# EAGLE board MTX_Tap_an_er_V11 (EAGLE 6.5.0)
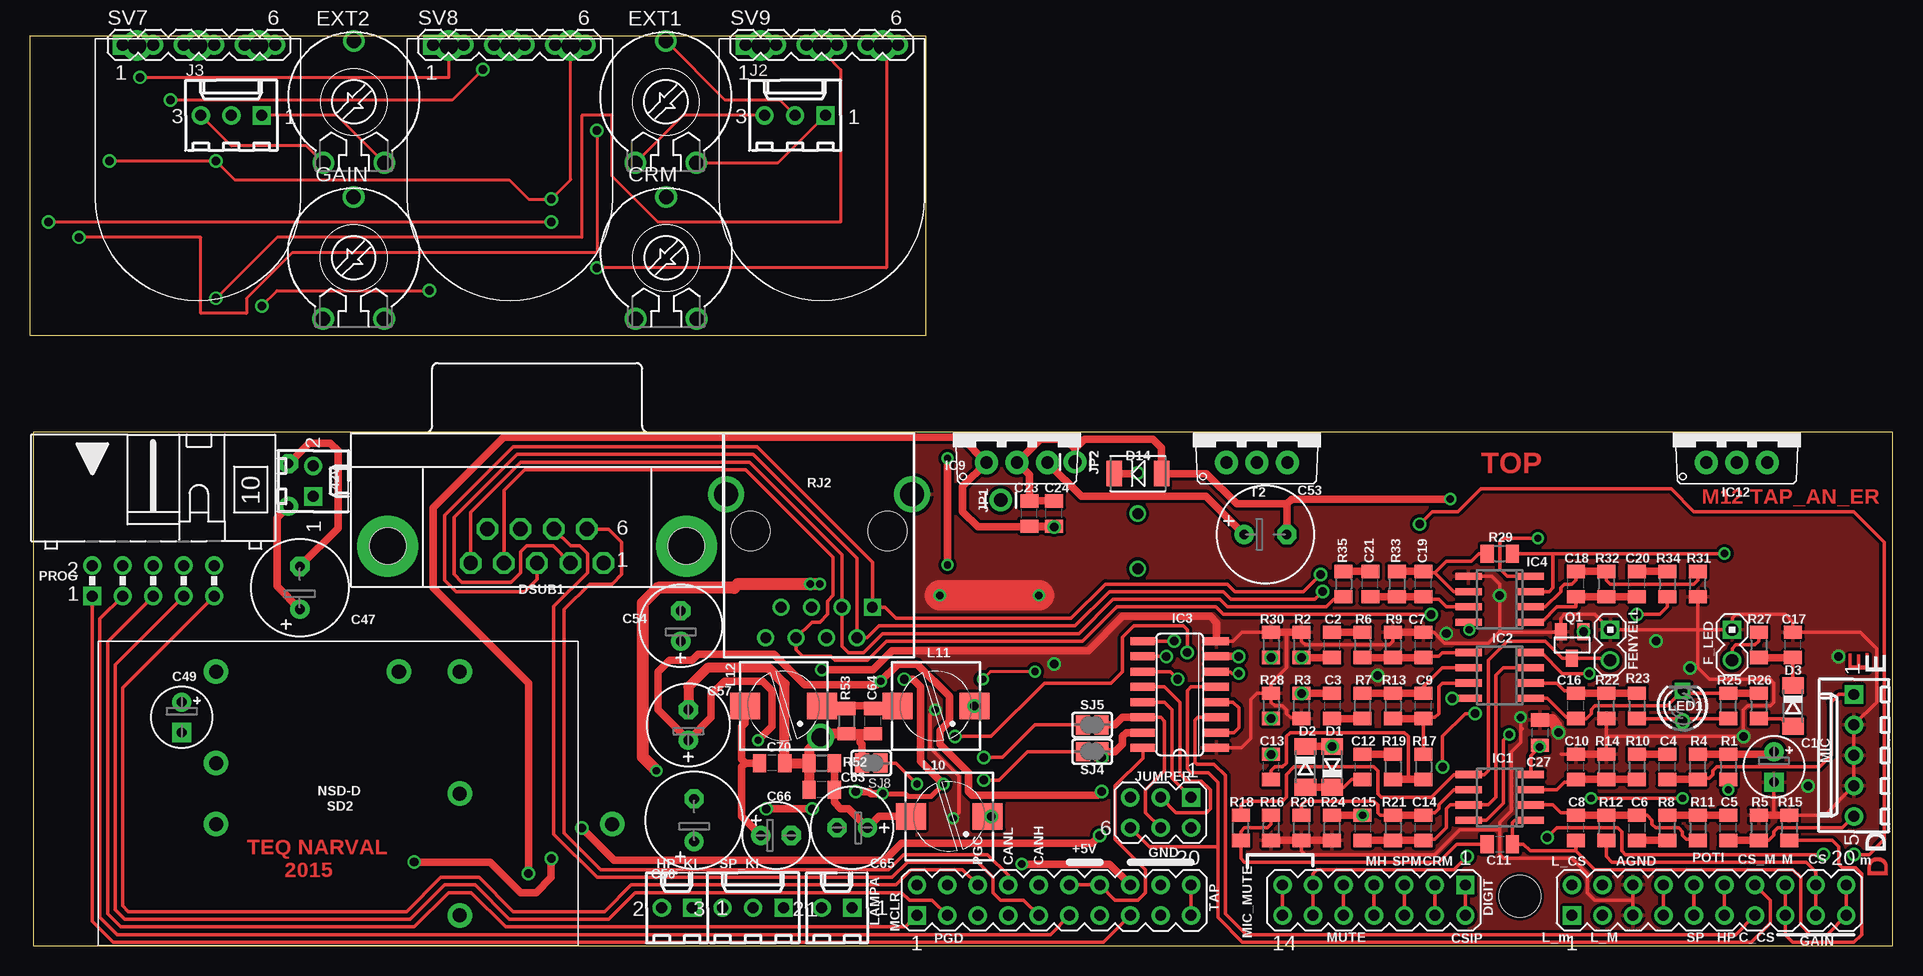
[diagram p2: board, top side]
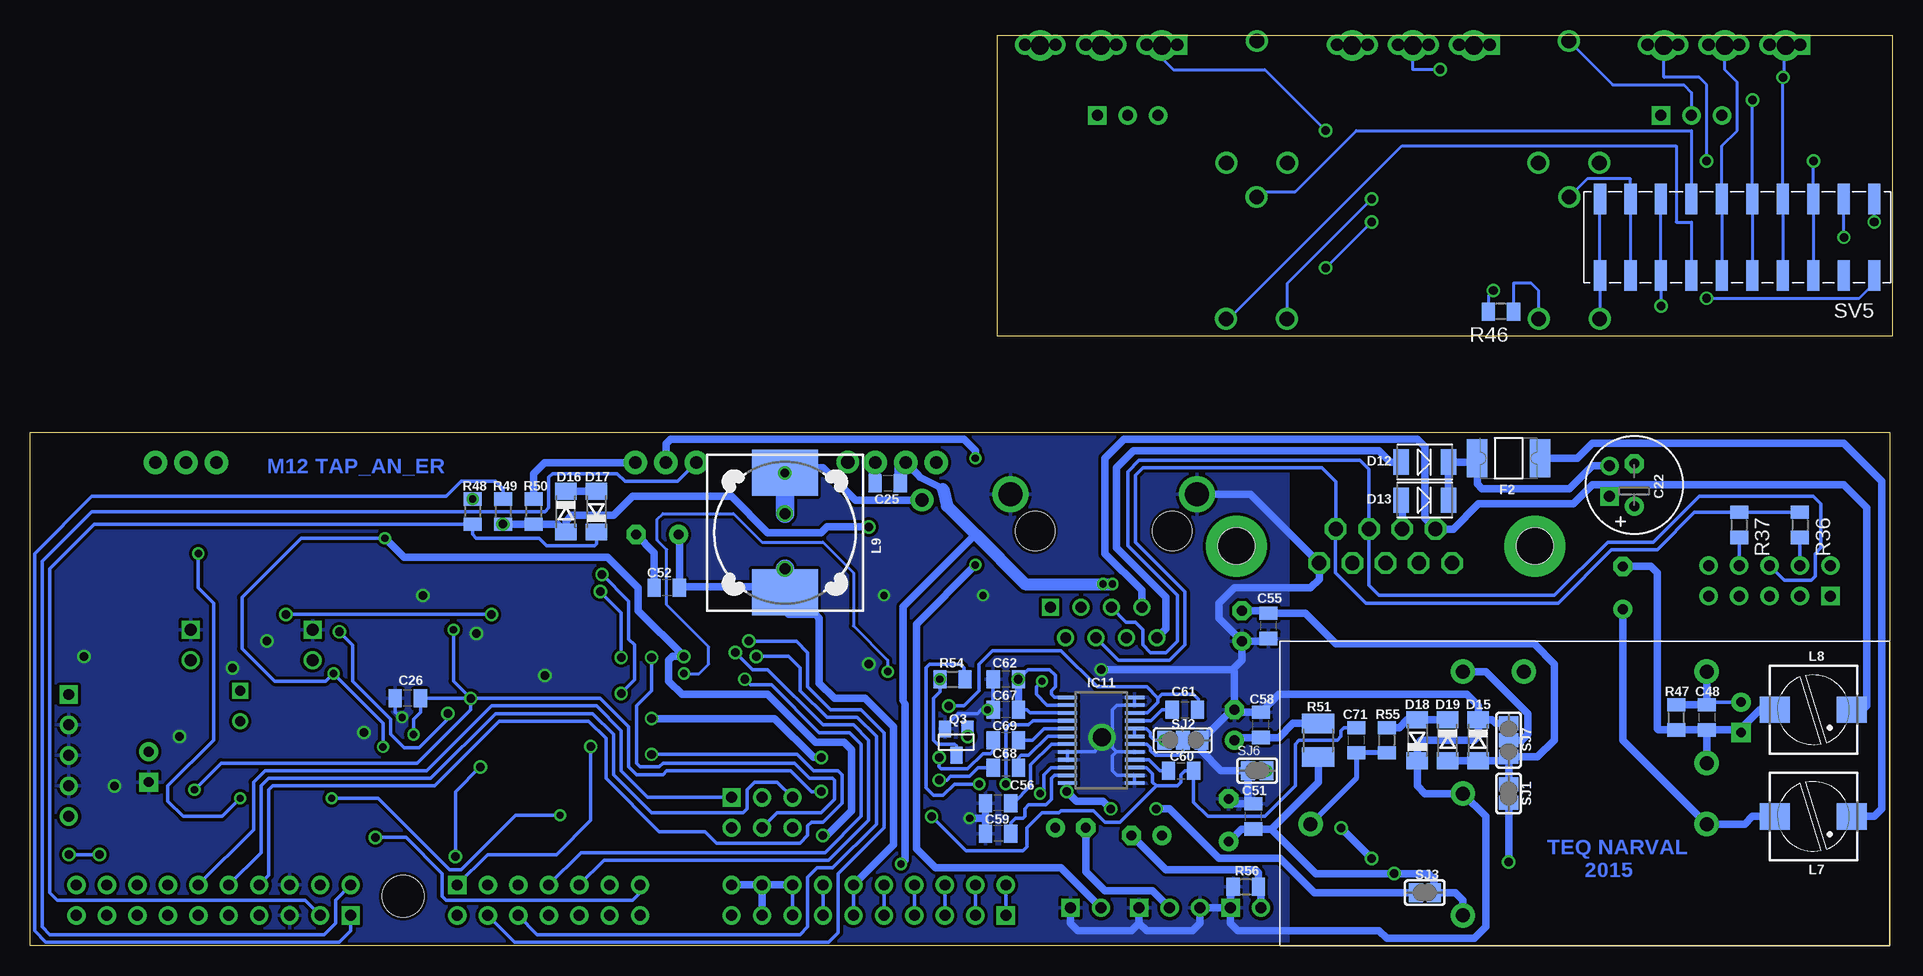
[diagram p3: board, bottom side, seen from below]

Size 155.27 x 75.84 mm. Coordinates in mm from the lower left corner, seen from the top.
Outline: 0.27,0 155.27,0 155.27,42.83 0.27,42.83 0.27,0
Outline: 0,75.84 74.65,75.84 74.65,50.84 0,50.84 0,75.84
Copper layers (1*16): Top 0.035mm / dielectric 1.5mm / Bottom 0.035mm
Design rules "10mil": minimum track width 10mil, minimum drill 24mil, track to track 10mil, track to pad 10mil, pad to pad 10mil, via to via 10mil, smd to smd 10mil, copper to edge 10mil, drill to drill 10mil, minimum pad ring 10mil, minimum via ring 8mil, stop-mask expansion 4mil, vias tented up to drill 0mil, thermal gap 10mil
Holes 3.5 mm at 124.17,4.13

## Footprints (pad centres in the part's own frame; a part is rotated, then mirrored left to right if it is on the bottom)
6410-02 = drill 0.914 pad 1.524 square: 1 1.27,0 | drill 0.914 pad 1.524: 2 -1.27,0
E2,5-5 = drill 0.813 pad 1.6: + -1.27,0 | drill 0.813 pad 1.6 square: - 1.27,0
C0805 = smd 1.1 x 1.5: 1 -1.05,0; 2 1.05,0
E3,5-8 = drill 0.813 pad 1.6: + -1.778,0 | drill 0.813 pad 1.6 octagon: - 1.778,0
E2,5-7 = drill 0.813 pad 1.6: + -1.27,0 | drill 0.813 pad 1.6 octagon: - 1.27,0
E2,5-6 = drill 0.813 pad 1.6: + -1.27,0 | drill 0.813 pad 1.6 octagon: - 1.27,0
PT-10 = drill 1.219: A -2.54,-5.08; E 2.54,-5.08; S 0,5.08
SOD80C = smd 1.4 x 1.8: A 1.7,0; C -1.7,0
DO-214AC = smd 1.27 x 2.1: 1 -1.98,0; 2 1.98,0
MA07-2 = drill 0.914 pad 1.524 square: 1 -7.62,-1.27 | drill 0.914 pad 1.524: 2 -7.62,1.27; 3 -5.08,-1.27; 4 -5.08,1.27; 5 -2.54,-1.27; 6 -2.54,1.27; 7 0,-1.27; 8 0,1.27; 9 2.54,-1.27; 10 2.54,1.27; 11 5.08,-1.27; 12 5.08,1.27; 13 7.62,-1.27; 14 7.62,1.27
182-009-MALE = drill 1.194 pad 1.524 octagon: 1 -5.537,10.923; 2 -2.769,10.923; 3 0,10.923; 4 2.769,10.923; 5 5.537,10.923; 6 -4.153,8.08; 7 -1.384,8.08; 8 1.384,8.08; 9 4.153,8.08 | drill 3.048 pad 5.08: P$1 -12.446,9.501; P$2 12.446,9.501 | hole 3.048: -12.446,9.501; 12.446,9.501
PTC1812L = smd 1.7 x 3.15: 1 -2.62,0; 2 2.62,0
PIN02_1 = drill 1.016 square: 1 0,0 | drill 1.016: 2 2.54,0
POT_NAR = drill 1.524 pad 2.54: A -5.08,-12.7; E 5.08,-12.7; S 0,-12.7
SO08 = smd 0.6 x 2.2: 1 -1.905,-2.6; 2 -0.635,-2.6; 3 0.635,-2.6; 4 1.905,-2.6; 5 1.905,2.6; 6 0.635,2.6; 7 -0.635,2.6; 8 -1.905,2.6
SO16 = smd 0.66 x 2.032: 1 -4.445,-3.073; 2 -3.175,-3.073; 3 -1.905,-3.073; 4 -0.635,-3.073; 5 0.635,-3.073; 6 1.905,-3.073; 7 3.175,-3.073; 8 4.445,-3.073; 9 4.445,3.073; 10 3.175,3.073; 11 1.905,3.073; 12 0.635,3.073; 13 -0.635,3.073; 14 -1.905,3.073; 15 -3.175,3.073; 16 -4.445,3.073
TO220V = drill 1.016 pad 1.93: 1 -2.54,-2.54; 2 0,-2.54; 3 2.54,-2.54
PWP-TSSOP24 = smd 1.6 x 0.3: 1 -2.8,3.575; 2 -2.8,2.925; 3 -2.8,2.275; 4 -2.8,1.625; 5 -2.8,0.975; 6 -2.8,0.325; 7 -2.8,-0.325; 8 -2.8,-0.975; 9 -2.8,-1.625; 10 -2.8,-2.275; 11 -2.8,-2.925; 12 -2.8,-3.575; 13 2.8,-3.575; 14 2.8,-2.925; 15 2.8,-2.275; 16 2.8,-1.625; 17 2.8,-0.975; 18 2.8,-0.325; 19 2.8,0.325; 20 2.8,0.975; 21 2.8,1.625; 22 2.8,2.275; 23 2.8,2.925; 24 2.8,3.575
6410-03 = drill 0.914 pad 1.524 square: 1 2.54,0 | drill 0.914 pad 1.524: 2 0,0; 3 -2.54,0
1X01_LONGPAD = drill 1.118 pad 1.88: 1 0,0
MA03-2 = drill 0.914 pad 1.524 square: 1 -2.54,-1.27 | drill 0.914 pad 1.524: 2 -2.54,1.27; 3 0,-1.27; 4 0,1.27; 5 2.54,-1.27; 6 2.54,1.27
PIS2816 = smd 2.2 x 2.5: 1 0,3.2; 2 0,-3.2
DR127 = smd 3.85 x 5.5: 1 -4.975,0; 2 4.975,0
LED3MM = drill 0.813: A -1.27,0 | drill 0.813 square: K 1.27,0
6410-05 = drill 0.914 pad 1.524 square: 1 5.08,0 | drill 0.914 pad 1.524: 2 2.54,0; 3 0,0; 4 -2.54,0; 5 -5.08,0
MA10-2 = drill 0.914 pad 1.524 square: 1 -11.43,-1.27 | drill 0.914 pad 1.524: 2 -11.43,1.27; 3 -8.89,-1.27; 4 -8.89,1.27; 5 -6.35,-1.27; 6 -6.35,1.27; 7 -3.81,-1.27; 8 -3.81,1.27; 9 -1.27,-1.27; 10 -1.27,1.27; 11 1.27,-1.27; 12 1.27,1.27; 13 3.81,-1.27; 14 3.81,1.27; 15 6.35,-1.27; 16 6.35,1.27; 17 8.89,-1.27; 18 8.89,1.27; 19 11.43,-1.27; 20 11.43,1.27
ML10L = drill 0.914 pad 1.524 square: 1 -5.08,-1.27 | drill 0.914 pad 1.524: 2 -5.08,1.27; 3 -2.54,-1.27; 4 -2.54,1.27; 5 0,-1.27; 6 0,1.27; 7 2.54,-1.27; 8 2.54,1.27; 9 5.08,-1.27; 10 5.08,1.27
SOT23 = smd 1 x 1.4: 1 -0.95,-1.1; 2 0.95,-1.1; 3 0,1.1
R0805 = smd 1.1 x 1.5: 1 -1.05,0; 2 1.05,0
R1210 = smd 1.6 x 2.7: 1 -1.4,0; 2 1.4,0
RJ45 = drill 0.9 pad 1.4 square: 1 -4.445,6.35 | drill 0.9 pad 1.4: 2 -3.175,8.89; 3 -1.905,6.35; 4 -0.635,8.89; 5 0.635,6.35; 6 1.905,8.89; 7 3.175,6.35; 8 4.445,8.89 | drill 2: S1 -7.77,-3.05; S2 7.77,-3.05 | hole 3.251: -5.715,0; 5.715,0
NSD-D = drill 1.168 pad 2.032: COMMON -10.16,0; CONTROL 10.16,-10.16; HACK -22.86,2.54; INPUT+ 10.16,2.54; INPUT- 10.16,-2.54; OUT+ -10.16,10.16; OUT- -10.16,-10.16; SZAB -5.08,-10.16
SOLDERJUMPER_CLOSEDWIRE = smd 1.168 x 1.6: 1 -0.762,0; 2 0.762,0 | smd 0.635 x 0.203: WIRE 0,0
SJ_2 = smd 1.168 x 1.6: 1 -1.524,0; 2 0,0; 3 1.524,0
SOLDERJUMPER_2WAY_OPEN_NOPASTE = smd 1.168 x 1.6: 1 -1.397,0; 2 0,0; 3 1.397,0
PIN_HEADER_2X10SMD = smd 1.016 x 2.54: 1A -11.43,3.175; 1B -11.43,-3.175; 2A -8.89,3.175; 2B -8.89,-3.175; 3A -6.35,3.175; 3B -6.35,-3.175; 4A -3.81,3.175; 4B -3.81,-3.175; 5A -1.27,3.175; 5B -1.27,-3.175; 6A 1.27,3.175; 6B 1.27,-3.175; 7A 3.81,3.175; 7B 3.81,-3.175; 8A 6.35,3.175; 8B 6.35,-3.175; 9A 8.89,3.175; 9B 8.89,-3.175; 10A 11.43,3.175; 10B 11.43,-3.175
MA06-1 = drill 1.016 pad 1.676 square: 1 -6.35,0 | drill 1.016 pad 1.676: 2 -3.81,0; 3 -1.27,0; 4 1.27,0; 5 3.81,0; 6 6.35,0

## Placement (x,y rotation side)
42V  22-27-2021-02  [6410-02]  23.61,38.73 270 top
C1  100u/16V  [E2,5-5]  145.37,14.92 270 top
C2  1u  [C0805]  108.54,25.08 90 top
C3  1u  [C0805]  108.54,20 270 top
C4  470n  [C0805]  136.48,14.92 90 top
C5  470n  [C0805]  141.56,9.84 90 top
C6  4n7  [C0805]  133.94,9.84 270 top
C7  220p  [C0805]  116.16,25.08 90 top
C8  22p  [C0805]  128.86,9.84 90 top
C9  220p  [C0805]  116.16,20 90 top
C10  47n  [C0805]  128.86,14.92 90 top
C11  470n  [C0805]  122.51,8.49 0 top
C12  100n  [C0805]  111.08,14.92 270 top
C13  470n  [C0805]  103.46,14.92 90 top
C14  470p  [C0805]  116.16,9.84 90 top
C15  470n  [C0805]  111.08,9.84 270 top
C16  470p  [C0805]  128.86,20 90 top
C17  10u  [C0805]  146.96,25.08 90 top
C18  470p  [C0805]  128.86,30.16 90 top
C19  470p  [C0805]  116.16,30.16 90 top
C20  10u  [C0805]  133.94,30.16 90 top
C21  10u  [C0805]  111.71,30.16 90 top
C22  220uF/50V  [E3,5-8]  21.54,38.42 90 bottom
C23  10u  [C0805]  83.3,36.04 90 top
C24  100n  [C0805]  85.36,36.04 90 top
C25  100n  [C0805]  83.77,38.58 0 bottom
C26  100n  [C0805]  123.78,20.64 180 bottom
C27  100n  [C0805]  125.84,17.78 270 top
C47  220uF/50V  [E3,5-8]  22.5,29.85 90 top
C48  [C0805]  15.51,19.05 270 bottom
C49  [E2,5-5]  12.65,19.05 270 top
C50  470uF/16V  [E3,5-8]  55.36,10.48 90 top
C51  100n  [C0805]  53.29,10.8 90 bottom
C52  100n  [C0805]  102.19,29.85 180 bottom
C53  470uF/16V  [E3,5-8]  102.98,34.29 0 top
C54  220uF/16V  [E2,5-7]  54.25,26.67 90 top
C55  100n  [C0805]  52.02,26.67 90 bottom
C56  1u  [C0805]  74.56,11.91 180 bottom
C57  220u/16V  [E2,5-7]  54.88,18.41 90 top
C58  100n  [C0805]  52.66,18.41 90 bottom
C59  1u  [C0805]  74.56,9.37 180 bottom
C60  1u  [C0805]  59.33,14.61 0 bottom
C61  1u  [C0805]  59.01,19.68 0 bottom
C62  100n  [C0805]  73.93,22.22 180 bottom
C63  390n  [C0805]  65.99,13.02 180 top
C64  390n  [C0805]  70.28,18.73 90 top
C65  220uF/16V  [E2,5-7]  68.53,9.84 180 top
C66  100uF/16V  [E2,5-6]  62.18,9.21 0 top
C67  10u  [C0805]  73.93,19.68 180 bottom
C68  1u  [C0805]  73.93,14.84 0 bottom
C69  1u  [C0805]  73.93,17.14 0 bottom
C70  390n  [C0805]  61.87,15.24 180 top
C71  220n  [C0805]  44.72,17.14 90 bottom
CRM  10k  [PT-10]  53.04,57.34 0 top
D1  1N4148  [SOD80C]  108.54,14.92 90 top
D2  1N4148  [SOD80C]  106.31,14.92 270 top
D3  1N4148  [SOD80C]  146.96,20 270 top
D12  SS16  [DO-214AC]  39.01,40.32 180 bottom
D13  SS16  [DO-214AC]  39.01,37.15 180 bottom
D14  SS16  [DO-214AC]  92.34,39.37 0 top
D15  12V  [SOD80C]  34.56,17.14 270 bottom
D16  1N4148  [SOD80C]  110.6,36.2 270 bottom
D17  1N4148  [SOD80C]  108.06,36.2 90 bottom
D18  1N4148  [SOD80C]  39.64,17.14 90 bottom
D19  1N4148  [SOD80C]  37.1,17.14 270 bottom
DIGIT  [MA07-2]  112.03,3.81 180 top
DSUB1  [182-009-MALE]  42.27,42.83 180 top
EXT1  [PT-10]  53,70.34 0 top
EXT2  [PT-10]  27,70.34 0 top
F2  1A  [PTC1812L]  32.02,40.64 0 bottom
F_LED  PIN02_1  [PIN02_1]  141.88,26.35 270 top
FENYELL  PIN02_1  [PIN02_1]  131.72,26.35 270 top
GAIN  10k  [PT-10]  26.96,57.34 0 top
HP  10k/LOG  [POT_NAR]  14,62.34 180 top
HP_KI  22-27-2021-02  [6410-02]  53.93,3.17 0 top
IC1  LM833D  [SO08]  122.51,12.38 90 top
IC2  LM833D  [SO08]  122.51,22.54 90 top
IC3  4053D  [SO16]  95.84,20.95 90 top
IC4  LM833D  [SO08]  122.51,28.89 90 top
IC9  7805TV  [TO220V]  82.27,42.83 0 top
IC11  TPA3123D2  [PWP-TSSOP24]  65.99,17.14 0 bottom
IC12  7805TV  [TO220V]  142.27,42.83 0 top
J2  22-27-2031-03  [6410-03]  63.77,69.22 0 top
J3  22-27-2031-03  [6410-03]  16.78,69.22 0 top
JP1  M01PTH_LONGPAD  [1X01_LONGPAD]  80.91,37.15 0 top
JP2  M01PTH_LONGPAD  [1X01_LONGPAD]  87.11,40.32 0 top
JUMPER  [MA03-2]  94.25,11.11 180 top
L7  47u  [PIS2816]  6.62,10.8 270 bottom
L8  47u  [PIS2816]  6.62,19.68 270 bottom
L9  DR127  [DR127]  92.34,34.45 270 bottom
L10  47u  [PIS2816]  76.63,10.8 270 top
L11  47u  [PIS2816]  75.52,20 270 top
L12  47u  [PIS2816]  62.82,20 270 top
LAMP  1k/LIN  [POT_NAR]  66,62.34 180 top
LAMPA  22-27-2021-02  [6410-02]  67.26,3.17 0 top
LED1  QT  [LED3MM]  137.75,20 90 top
MIC  22-27-2051-05  [6410-05]  152.03,15.88 90 top
POTI  [MA10-2]  139.97,3.81 0 top
PROG  [ML10L]  10.27,30.43 0 top
Q1  MOSFET-NCHANNELBSS138  [SOT23]  128.54,25.08 180 top
Q3  MOSFET-NCHANNELBSS123LT1G  [SOT23]  78.06,16.99 180 bottom
R1  10k  [R0805]  141.56,14.92 270 top
R2  10k  [R0805]  106,25.08 270 top
R3  10k  [R0805]  106,20 90 top
R4  10k  [R0805]  139.02,14.92 90 top
R5  1k  [R0805]  144.1,9.84 270 top
R6  22k  [R0805]  111.08,25.08 270 top
R7  22k  [R0805]  111.08,20 90 top
R8  4k7  [R0805]  136.48,9.84 90 top
R9  22k  [R0805]  113.62,25.08 270 top
R10  15k  [R0805]  133.94,14.92 270 top
R11  4k7  [R0805]  139.02,9.84 270 top
R12  10k  [R0805]  131.4,9.84 270 top
R13  22k  [R0805]  113.62,20 270 top
R14  1k  [R0805]  131.4,14.92 270 top
R15  470  [R0805]  146.64,9.84 270 top
R16  3k3  [R0805]  103.46,9.84 90 top
R17  220  [R0805]  116.16,14.92 270 top
R18  6k8  [R0805]  100.92,9.84 90 top
R19  10k  [R0805]  113.62,14.92 270 top
R20  3k3  [R0805]  106,9.84 90 top
R21  10k  [R0805]  113.62,9.84 270 top
R22  2k2  [R0805]  131.4,20 90 top
R23  10k  [R0805]  133.94,20 270 top
R24  10k  [R0805]  108.54,9.84 90 top
R25  47k  [R0805]  141.56,20 90 top
R26  100  [R0805]  144.1,20 270 top
R27  2k2  [R0805]  144.1,25.08 270 top
R28  10k  [R0805]  103.46,20 270 top
R29  4k7  [R0805]  122.51,32.7 0 top
R30  10k  [R0805]  103.46,25.08 270 top
R31  5k6  [R0805]  139.02,30.16 90 top
R32  22k  [R0805]  131.4,30.16 270 top
R33  22k  [R0805]  113.94,30.16 270 top
R34  100  [R0805]  136.48,30.16 270 top
R35  100  [R0805]  109.49,30.16 270 top
R36  120  [R0805]  7.73,35.08 270 bottom
R37  470  [R0805]  12.81,35.08 270 bottom
R46  470  [R0805]  32.66,52.86 180 bottom
R47  [R0805]  18.05,19.05 90 bottom
R48  3k3  [R0805]  118.38,36.2 270 bottom
R49  470  [R0805]  115.84,36.2 270 bottom
R50  4R7  [R0805]  113.3,36.2 270 bottom
R51  10  [R1210]  47.9,17.14 270 bottom
R52  1k  [R0805]  65.99,15.24 0 top
R53  1k  [R0805]  68.06,18.73 270 top
R54  10k  [R0805]  78.38,22.22 0 bottom
R55  10  [R0805]  42.18,17.14 270 bottom
R56  10k  [R0805]  53.93,4.92 180 bottom
RJ2  RJ45-6L-BSIMA  [RJ45]  65.77,34.58 180 top
SD2  NSD-D  [NSD-D]  25.67,12.7 180 top
SJ1  [SOLDERJUMPER_CLOSEDWIRE]  32.02,12.7 90 bottom
SJ2  [SJ_2]  59.17,17.14 0 bottom
SJ3  [SOLDERJUMPER_CLOSEDWIRE]  39.01,4.45 180 bottom
SJ4  [SOLDERJUMPER_CLOSEDWIRE]  88.53,16.19 0 top
SJ5  [SOLDERJUMPER_CLOSEDWIRE]  88.53,18.41 0 top
SJ6  [SOLDERJUMPER_CLOSEDWIRE]  52.98,14.61 0 bottom
SJ7  [SOLDERJUMPER_2WAY_OPEN_NOPASTE]  32.02,17.14 90 bottom
SJ8  [SOLDERJUMPER_CLOSEDWIRE]  70.12,15.24 180 top
SP  10k/LOG  [POT_NAR]  40,62.34 180 top
SP_KI  22-27-2031-03  [6410-03]  60.28,3.17 0 top
SV5  PIN_HEADER_2X10  [PIN_HEADER_2X10SMD]  12.97,59.05 180 bottom
SV7  [MA06-1]  14.08,75.09 0 top
SV8  [MA06-1]  39.96,75.09 0 top
SV9  [MA06-1]  65.99,75.09 0 top
T2  BD242  [TO220V]  102.27,42.83 0 top
TAP  [MA10-2]  85.36,3.81 0 top

## Tracks (layer width: path | path; a pad name or v marks a point on that pad's centre or on a via)
1.
  Top 0.305: IC2.7 117.74,21.91 117.43,21.59 117.43,19.37 117.11,19.05 116.25,19.05 C9.1 R17.1
  Top 0.61: C9.1 R13.2
12V_TAP  (via drill 0.71)
  Top 0.305: DIGIT.13 DIGIT.14 | v126.48,9.05 127.27,9.84 132.35,9.84 132.67,9.52 132.67,7.94 132.99,7.62 v149.5,7.62 | v152.03,7.62 153.31,7.62 154.58,8.89 154.58,33.66 152.03,36.2 138.7,36.2 136.8,38.1 120.92,38.1 119.02,36.2 116.89,36.2 R49.2
  Top 0.61: v41.55,6.03 41.55,21.91 33.61,29.85 33.61,36.51 39.48,42.39 77.63,42.39 IC9.1 77.74,38.3 77.74,36.2 79.01,34.93 83.23,34.93 | v85.36,34.93 83.23,34.93 | 83.23,34.93 C23.1 C24.1
  Bottom 0.305: DIGIT.13 104.41,4.45 105.05,3.81 120.6,3.81 120.92,4.13 120.92,6.03 123.94,9.05 v126.48,9.05 | v149.5,7.62 v152.03,7.62
  Bottom 0.61: SD2.OUT+ 35.83,3.81 36.47,4.45 SJ3.1 38.24,5.59 38.69,6.03 v41.55,6.03 48.09,6.03 51.8,9.75 | R51.2 47.9,13.65 51.8,9.75 | R49.2 R50.2 111.3,35.15 111.08,34.93 D16.A 110.6,35.4 110.12,35.88 106.63,35.88 105.05,37.47 96.79,37.47 93.77,34.45 89.33,34.45 88.85,34.93 v85.36,34.93 | 51.8,9.75 C51.1 54.31,9.75 C50.+
  other vias: 115.84,35.15
!MCLR
  Top 0.305: PROG.5 6.46,25.35 6.46,2.7 7.57,1.59 32.02,1.59 34.88,4.45 36.78,4.45 39.64,1.59 72.98,1.59 TAP.1
  Bottom 0.305: TAP.2 TAP.1
+5V
  Top 0.305: TAP.11 85.04,0.95 7.26,0.95 5.83,2.38 5.83,27.25 PROG.3 | TAP.12 TAP.14 90.44,3.81 92.34,3.81 92.98,4.45 92.98,6.35 90.44,8.89 90.44,13.34 92.76,15.66 IC3.16
  Top 0.61: IC9.3 87.63,37.47 98.03,37.47 C53.+
  Bottom 0.305: TAP.12 TAP.11 | TAP.14 TAP.13 | 99.17,29.79 99.33,29.95
  Bottom 0.61: L9.2 92.98,29.95 | 92.98,29.95 99.33,29.95 101.03,29.95 C52.1 101.14,34.22 C53.+ | TAP.12 83.3,8.41 83.3,18.26 85.68,20.64 88.22,20.64 89.49,21.91 89.49,27.3 89.8,27.62 92.03,27.62 92.34,27.94 92.34,29.32 92.98,29.95
  Bottom 1.016: C25.1 84.82,40.27 IC9.3
+12V  (via drill 0.61, 0.71, 0.71 pad 1.12)
  Top 0.406: v71.07,12.7 72.98,12.7 73.22,12.46 75.12,12.46 v76.15,13.49
  Top 0.61: v71.07,12.7 70.12,12.7 69.96,12.86 v68.85,12.86 | v76.15,13.49 74.25,15.4 74.25,21.59 73.61,22.22 C62.1 | v61.39,11.43 v65.2,11.43
  Bottom 0.305: v68.85,12.86 68.85,13.51 IC11.12 | v76.15,13.49 78.22,13.49 79.17,12.54 79.96,12.54 80.6,13.18 80.6,23.18 80.28,23.5 77.74,23.5 77.42,23.18 77.42,22.32 R54.2 | IC11.10 70.17,14.87 70.75,14.29 70.75,13.02 v71.07,12.7 | IC11.3 71.92,19.42 72.18,19.68 C67.1 | IC11.1 69.88,20.72 70.12,20.95 70.12,21.27 69.8,21.59 69.8,22.54 70.28,23.02 72.09,23.02 C62.1
  Bottom 0.61: C62.1 C67.1 | SJ3.2 48.21,4.45 51.07,7.3 56.15,7.3 60.28,11.43 v61.39,11.43 | v65.2,11.43 65.83,12.07 68.06,12.07 v68.85,12.86
  other vias: 72.88,22.22
+24V
  Bottom 0.61: D13.1 D12.1 34.96,40.32 F2.1 34.64,38.5 34.24,38.1 26.94,38.1 25.04,40.01 42V.2
-24V
  Bottom 0.61: 23.77,38.42 25.04,38.42 26.62,36.83 34.56,36.83 36.65,34.75 DSUB1.9 39.01,35.63 39.01,41.59 39.64,42.23 64.09,42.23 65.67,40.64 65.67,32.7 62.6,29.62 RJ2.7 | 23.77,38.42 4.08,38.42 2.17,36.51 2.17,20 2.49,19.68 L8.1 | 42V.1 23.61,38.26 23.77,38.42
AGND  (via drill 0.6, 0.61, 0.71, 1.5)
  Top 0.305: R31.1 139.02,26.35 | 139.02,26.35 FENYELL.1 130.45,27.62 127.91,27.62 127.59,27.31 Q1.2 127.22,26.13 122.51,26.13 | 139.02,26.35 F_LED.1 141.88,27.3 142.19,27.62 146.32,27.62 146.96,26.99 C17.2 152.57,26.13 153.94,24.77 153.94,20.32 MIC.2 MIC.3 MIC.4 149.59,10.89 R15.1 | R2.1 106,25.4 106.31,25.08 113.3,25.08 113.62,25.4 R9.1 | R28.1 103.46,20.32 103.77,20 104.41,20 104.73,19.68 104.73,19.37 105.05,19.05 105.9,19.05 R3.1 | R30.1 101.02,26.13 100.28,25.4 IC3.8 | R14.1 131.4,17.46 | 131.4,17.46 R22.1 | C7.2 117.01,26.13 117.9,25.24 121.55,25.24 122.45,26.13 122.51,26.13 | IC4.5 121.87,30.8 122.51,30.16 v122.51,29.21 122.51,26.13 | C1.- 145.37,10.89 | R28.1 103.46,21.91 104.73,23.18 104.73,25.97 104.89,26.13 | 131.4,17.46 142.51,17.46 142.83,17.78 142.83,19.68 143.15,20 145.05,20 145.37,20.32 145.37,21.91 145.05,22.22 139.97,22.22 139.02,23.18 139.02,26.35 | 133.62,3.81 130.45,3.81 129.81,4.45 129.81,6.03 128.54,7.3 122.83,7.3 122.51,7.62 122.51,9.68 | 122.51,9.68 122.51,10.32 123.46,11.27 123.46,16.19 124.25,16.99 v124.25,19.05 124.25,18.26 124.41,18.1 | 127.65,15.97 C10.2 | R20.1 106,7.94 106.31,7.62 117.11,7.62 119.17,9.68 122.51,9.68 | POTI.5 133.62,3.81 | 133.62,3.81 POTI.6 | IC3.1 101,16.51 101.79,17.3 101.79,20.56 102.28,21.05 R28.1 | v75.46,19.68 75.04,19.27 75.04,16.51 77.42,14.13 77.42,11.11 v76.95,10.64
  Top 0.61: R30.1 104.89,26.13 R2.1 | R9.1 C7.2 | R16.1 R20.1 R24.1 | R5.1 145.37,10.89 R15.1 | C10.2 R14.1 | v65.99,23.02 70.28,23.02 71.87,24.61 88.22,24.61 91.08,27.46 98.38,27.46 98.91,26.93 IC3.8 | SJ8.2 69.36,16.8 69.17,16.99 69.17,17.68
  Top 0.813: R52.1 C70.1 62.92,21.81 61.55,23.18 56.47,23.18 54.88,21.59 C57.- | R52.1 C63.2 | C64.1 69.17,17.68 R53.2 66.21,17.68 v65.91,17.38 64.94,16.41 R52.1
  Top 1.016: C27.1 126.85,18.83 127.27,18.26 v127.43,17.78
  Top 2.54: v75.83,29.21 v84.09,29.21
  Bottom 0.305: v75.46,19.68 75.99,19.68 76.31,19.37 77.9,19.37 78.71,18.56 Q3.2 | IC11.24 IC11.23 64.66,20.07 65.04,19.68 65.04,17.62 v65.91,17.38 | IC11.13 IC11.14 64.66,14.22 65.04,14.61 65.04,15.83 64.7,16.17 | IC11.9 IC11.8 66.49,16.17 v65.91,17.38 | IC11.17 64.7,16.17 | v65.91,17.38 65.04,17.14 65.04,16.51 64.7,16.17 | v75.46,19.68 74.98,19.11 | C26.2 124.83,19.46 v124.25,19.05 | C62.2 74.98,19.84 v75.46,19.68
  Bottom 0.61: D15.C 34.56,17.46 34.88,17.14 39.32,17.14 39.64,16.83 D18.C 39.64,13.34 39.01,12.7 SD2.COMMON 33.93,10.8 33.93,1.59 34.88,0.64 42.18,0.64 42.82,1.27 54.56,1.27 55.2,1.91 HP_KI.1 | C54.+ 52.24,25.4 C55.1 | HP_KI.1 SP_KI.3 57.74,1.91 58.37,1.27 62.18,1.27 62.82,1.91 | 62.82,1.91 SP_KI.1 | 62.82,1.91 63.45,1.27 67.9,1.27 68.53,1.91 LAMPA.1 | RJ2.S2 53.53,37.62 DSUB1.1 47.81,30.57 48.53,29.85 54.88,29.85 56.15,28.57 56.15,27.3 C54.+ | D15.C 34.56,20 35.51,20.95 51.17,20.95 C58.2 54.66,19.46 C57.- | v65.99,23.02 55.04,23.02 | R56.2 55.2,4.7 HP_KI.1 | C56.2 75.61,10.89 75.83,10.64 | 75.83,10.64 v76.95,10.64 | 55.04,23.02 54.88,22.86 C57.- | C54.+ 54.25,23.81 55.04,23.02 | C59.2 75.61,10.42 75.83,10.64 | C50.- 54.95,11.84 C51.2 53.74,12.29 SJ6.1 55.99,14.61 57.64,16.26 SJ2.3 55.1,19.68 C57.- | SJ7.3 33.1,18.54 33.4,18.84 D15.C
  other vias: 85.36,23.5 118.06,26.04 112.35,22.54 135.53,25.4 150.77,24.13 138.38,23.18 148.23,13.34 142.83,17.46
  pour Top: 159.02,48.26 73.93,48.26 73.93,-5.71 159.02,-5.71
  pour Bottom: 50.44,45.72 158.39,45.09 158.39,-1.27 50.44,-0.63
CANH
  Top 0.305: TAP.9 82.82,3.81 80.91,3.81 80.28,4.45 80.28,5.72 79.01,6.99 73.14,6.99 71.87,5.72 47.26,5.72 43.65,9.32 43.65,28.3 46.47,31.11 46.47,32.7 45.83,33.34 45.06,33.34 DSUB1.7
  Bottom 0.305: RJ2.5 63.9,26.99 63.14,26.99 62.5,26.35 62.5,25.08 61.87,24.45 60.6,24.45 59.64,25.4 59.64,29.21 63.77,33.34 63.77,39.53 62.82,40.48 44.4,40.48 43.65,39.73 DSUB1.7 43.65,30.05 42.82,29.21 28.21,29.21 23.77,33.66 19.95,33.66 16.14,37.47 6.62,37.47 5.98,36.83 5.98,33.18 6.46,32.7 6.46,30.8 6.78,30.48 9.05,30.48 PROG.6 | TAP.10 TAP.9
CANL
  Top 0.305: TAP.8 81.55,5.87 79.8,7.62 72.82,7.62 71.55,6.35 47.58,6.35 44.52,9.41 44.52,28.05 46.62,30.16 48.53,30.16 49.32,30.96 49.32,33.66 48.23,34.75 DSUB1.6
  Bottom 0.305: RJ2.4 64.53,23.81 60.28,23.81 59.01,25.08 59.01,29.53 63.14,33.66 63.14,39.21 62.5,39.85 47.58,39.85 46.42,38.69 DSUB1.6 46.47,34.7 46.47,31.11 43.93,28.57 27.89,28.57 23.45,33.02 19.64,33.02 16.52,36.13 R37.1 R36.1 | TAP.8 TAP.7
CLK
  Top 0.305: PROG.9 7.73,21.54 7.73,3.33 8.21,2.86 31.38,2.86 34.24,5.72 37.42,5.72 40.28,2.86 47.9,2.86 50.12,5.08 72.18,5.08 73.45,6.35 77.74,6.35 TAP.6
  Bottom 0.305: TAP.6 TAP.5
CRM  (via drill 0.71)
  Top 0.305: IC3.9 v95.36,25.4 | DIGIT.4 DIGIT.3
  Bottom 0.305: DIGIT.4 114.89,0.32 88.69,0.32 87.9,1.11 87.9,6.03 84.09,9.84 84.09,17.78 85.99,19.68 88.53,19.68 90.44,21.59 90.44,24.45 91.39,25.4 v95.36,25.4
CROSSMUTE_CS
  Top 0.305: POTI.13 142.19,0.95 101.39,0.95 99.65,2.7 99.65,14.21 98.69,15.16 97.27,15.16 97.11,15.32 97.11,18.81 97.35,19.05 IC3.3
CROSSMUTE_MAX
  Top 0.305: JUMPER.6 93.3,8.25 99.01,8.25 | 99.01,8.25 99.01,13.65 98.22,14.45 96.79,14.45 96.47,14.76 96.47,21.27 96.79,21.59 IC3.5 | 99.01,8.25 99.01,2.38 101.08,0.32 143.46,0.32 145.05,1.91 145.05,3.81 POTI.14
CSIP  (via drill 0.71)
  Top 0.305: DIGIT.2 DIGIT.1
  Top 0.61: D2.C D1.A
  Bottom 0.305: D1.A 108.54,10.48 111.39,7.62 117.11,7.62 DIGIT.1
  other vias: 108.54,16.62
DAT
  Top 0.305: PROG.7 7.1,23.44 7.1,3.02 7.89,2.22 31.7,2.22 34.56,5.08 37.1,5.08 39.96,2.22 48.21,2.22 50.44,4.45 72.66,4.45 73.3,3.81 75.2,3.81 TAP.3
  Bottom 0.305: TAP.4 TAP.3
DIN_MIC
  Top 0.305: R5.2 144.95,8.79 145.37,9.21 145.37,9.52 145.69,9.84 151.08,9.84 MIC.5
  Top 0.61: R5.2 C5.1
EL_MIC
  Top 0.305: MIC.1 150.77,20.95 150.13,20.32 150.13,15.88 149.18,14.92 140.61,14.92 140.29,14.61 140.29,14.29 139.97,13.97 139.12,13.97 R4.1
  Top 0.61: R4.1 C4.1
GAIN_CS
  Top 0.305: R12.2 131.4,7.46 131.87,6.99 148.07,6.99 148.86,6.19 POTI.18 POTI.17
GAIN_MAX
  Top 0.305: POTI.16 POTI.15 146.32,0.95 146.96,0.32 152.03,0.32 152.67,0.95 152.67,6.03 152.19,6.51 151.08,6.51 150.77,6.83 150.77,8.25 150.23,8.79 R15.2
GAIN_MIN
  Top 0.305: 128.86,7.94 130.45,6.35 146.96,6.35 147.59,5.72 147.59,1.75 148.38,0.95 149.81,0.95 POTI.19 POTI.20 | IC1.1 123.78,10.48 123.56,10.26 C11.2 124.49,8.49 125.05,7.94 128.86,7.94 | C8.1 128.86,7.94
GND  (via drill 0.6, 0.61)
  Top 0.305: TAP.15 89.49,0.32 6.94,0.32 5.19,2.07 PROG.1 | TAP.20 TAP.19
  Top 0.61: v82.66,6.83 89.96,6.83 TAP.16 | C24.2 C23.2 83.3,39.26 IC9.2 84.21,42.23 86.31,42.23 87.11,41.43 | JP2.1 87.11,41.43 | 87.11,41.43 87.9,42.23 93.61,42.23 94.33,41.52 D14.2 98.06,39.37 100.6,36.83 104.76,36.83 | 104.76,36.83 C53.- | R48.1 105.17,37.25 104.76,36.83
  Top 1.016: v65.83,30.16 v65.04,30.16 59.01,30.16 58.69,29.85 52.34,29.85 51.07,28.57 51.07,15.75 SJ6.2
  Bottom 0.305: TAP.16 TAP.15
  Bottom 0.61: v82.66,6.83 82.34,7.14 82.34,20.16 82.5,20.48 82.5,28.26 76.47,34.29 | 79.17,38.1 81.07,39.05 81.23,39.25 IC9.2 | TAP.16 TAP.18 | TAP.18 TAP.20 | TAP.17 TAP.18 | C52.2 103.24,32.77 C53.-
  Bottom 1.016: 79.17,38.1 78.85,36.67 76.47,34.29 72.34,30.16 v65.83,30.16 | 65.67,30.16 v65.04,30.16 | C25.2 82.72,39.83 IC9.2
  other vias: 118.38,37.25 52.21,14.61
HP
  Top 0.305: IC3.13 94.57,20.32 95.2,19.68 95.2,13.97 JUMPER.1 | POTI.11 POTI.12
  Bottom 0.305: JUMPER.1 103.77,12.38 106,14.61 106,17.94 108.06,20 116.79,20 122.19,14.61 135.68,14.61 136.64,13.65 136.64,9.68 POTI.12
HPIN_X  (via drill 0.71)
  Top 0.305: SJ5.1 83.77,18.41 81.07,15.72 v79.49,15.72
  Bottom 0.305: C69.1 74.98,16.25 75.2,16.03 75.83,16.03 77.1,14.76 79.33,14.76 79.49,14.92 v79.49,15.72
HPOUT  (via drill 0.71)
  Top 0.305: v78.69,20 L11.1
  Bottom 0.305: IC11.22 62.13,19.42 61.23,20.32 61.23,20.64 | 61.23,20.64 60.91,20.95 58.29,20.95 57.88,20.54 57.88,19.68 C61.2 | v78.69,20 77.42,20 76.15,21.27 76.15,23.5 75.04,24.61 69.33,24.61 66.31,21.59 62.18,21.59 61.23,20.64
IN+  (via drill 0.71)
  Top 0.305: v107.74,29.53 107.11,28.89 100.12,28.89 99.49,29.53 89.96,29.53 87.11,26.67 70.75,26.67 69.77,25.68 RJ2.2 68.94,32.29 60.28,40.96 40.59,40.96 35.35,35.72 35.35,30.96 35.99,30.32 40.12,30.32 40.91,31.11 40.91,32.86 41.39,33.34 43.6,33.34 DSUB1.2
  Top 0.61: C2.1 R2.2
  Bottom 0.305: v107.74,29.53 106,27.78 R2.2
  other vias: 106,24.03
IN-  (via drill 0.71)
  Top 0.305: v107.58,30.96 106.16,29.53 100.44,29.53 99.81,30.16 89.65,30.16 86.79,27.3 72.18,27.3 71.26,28.22 RJ2.1 70.21,31.97 60.6,41.59 40.28,41.59 34.56,35.88 34.56,30.48 35.51,29.53 41.23,29.53 42.27,30.57 DSUB1.3
  Top 0.61: R3.2 C3.1
  Bottom 0.305: v107.58,30.96 105.36,28.73 105.36,25.56 104.89,25.08 104.89,22.16 R3.2
  other vias: 106,21.05
LAMPA_CS
  Bottom 0.305: POTI.2 129.81,3.81 129.81,1.91 130.76,0.95 153.62,0.95 154.26,1.59 154.26,32.07 150.13,36.2 112.35,36.2 112.03,36.51 112.03,39.05 111.71,39.37 106.31,39.37 105.68,38.73 101.28,38.73 T2.1
LAMPA_MAX
  Bottom 0.305: D17.C 108.06,33.5 108.22,33.34 112.19,33.34 112.82,33.97 118.06,33.97 118.38,34.29 R48.2 149.91,35.15 153.62,31.43 153.62,4.45 152.99,3.81 132.35,3.81 POTI.3
LAMPA_MIN
  Bottom 0.305: POTI.1 128.54,1.27 129.49,0.32 153.94,0.32 154.89,1.27 154.89,32.7 150.13,37.47 120.6,37.47 119.33,38.73 116.47,38.73 115.84,38.1 R49.1
MH  (via drill 0.71)
  Top 0.305: IC3.11 95.04,22.86 v95.68,22.22 | DIGIT.8 DIGIT.7
  Bottom 0.305: DIGIT.7 109.33,7.78 89.01,7.78 85.99,10.8 85.99,16.83 86.95,17.78 89.49,17.78 93.46,21.75 95.2,21.75 v95.68,22.22
MIC_MUTE  (via drill 0.71)
  Top 0.305: DIGIT.12 DIGIT.11 106.95,6.03 107.27,6.35 118.7,6.35 v119.81,7.46 | v117.74,14.92 117.74,17.46 119.65,19.37 v120.44,19.37
  Bottom 0.305: v119.81,7.46 119.81,12.86 v117.74,14.92 | Q1.1 128.38,25.07 128.38,22.07 125.21,18.89 125.21,17.62 124.09,16.51 122.83,16.51 120.44,18.89 v120.44,19.37
  other vias: 129.49,26.18
MUTE  (via drill 0.71)
  Top 0.305: DIGIT.9 DIGIT.10 | v96.47,24.45 96.47,26.35 96.16,26.67 92.03,26.67 91.08,25.72 91.08,22.86 90.12,21.91 84.57,21.91 80.12,17.46 v77.1,17.46
  Bottom 0.305: Q3.1 77.1,17.9 v77.1,17.46 | DIGIT.9 107.43,7.14 88.69,7.14 85.36,10.48 85.36,17.14 86.63,18.41 89.17,18.41 93.77,23.02 95.04,23.02 v96.47,24.45
N$1
  Top 0.61: R4.2 R1.1 145.15,15.97 C1.+
N$2
  Top 0.61: C4.2 R10.1
N$3
  Top 0.61: R8.2 R11.1 C5.2
N$4
  Top 0.305: IC1.3 127.27,13.02 127.91,13.65 128.64,13.65 C10.1
  Top 0.61: R10.2 R14.2 C10.1
N$5
  Top 0.305: IC1.2 126.95,11.75 127.59,11.11 128.64,11.11 C8.2 | C6.1 134.79,10.89 135.21,10.48 135.21,10.16 135.53,9.84 137.43,9.84 137.75,9.52 137.75,9.21 138.06,8.89 138.92,8.89 R11.2
  Top 0.61: C8.2 R12.1 C6.1
N$6
  Bottom 0.61: SJ7.1 32.32,15.45 D15.A D19.A | SJ1.2 SJ7.1 | C54.- 52.24,27.94 C55.2 48.95,27.72 46.41,25.18 29.89,25.18 28.21,23.5 28.21,17.14 29.61,15.75 SJ7.1
N$7
  Bottom 0.61: RJ2.8 60.6,26.41 60.6,29.05 64.72,33.18 64.72,39.85 63.29,41.28 42.82,41.28 41.86,40.32 D12.2
N$8
  Top 0.61: C6.2 R8.1
N$9
  Top 0.305: FENYELL.2 131.55,23.98 Q1.3 127.73,23.98 126.32,25.4 123.14,25.4 121.55,23.81 121.55,14.61 121.24,14.29 IC1.5 118.7,14.29 116.79,12.38 112.66,12.38 112.35,12.7 112.35,14.61 112.03,14.92 105.36,14.92 104.73,14.29 104.73,12.38 104.41,12.07 101.23,12.07 100.92,11.75 R18.2
N$10
  Bottom 0.254: SV5.7A 16.78,60.33 18.05,60.33 18.05,66.67 40.91,66.67 54.88,52.71 CRM.E
N$11  (via drill 0.71 pad 1.12)
  Top 0.254: v6.62,65.41 v15.51,65.41 17.08,63.84 39.94,63.84 41.55,62.23 v43.45,62.23 45.08,63.86 SP.A
  Bottom 0.254: v43.45,62.23 50.5,55.19 CRM.A | v15.51,65.41 15.51,71.76 16.14,72.39 19.08,72.39 HP.A | v6.62,65.41 SV5.3B SV5.3A
N$12
  Top 0.305: IC3.4 100.28,20.32 100.76,19.84 100.76,18.18 100.36,17.78 IC3.2
N$13
  Top 0.305: R16.2 103.46,10.16 103.14,9.84 101.23,9.84 100.92,9.52 R18.1 100.92,7.3 101.23,6.99 117.43,6.99 118.94,8.49 C11.1
N$14
  Top 0.305: IC4.2 126.32,28.26 127.59,29.53 127.59,29.85 127.91,30.16 128.54,30.16 128.86,30.48 C18.2 128.76,31.11 | R32.1 131.4,30.48 131.72,30.16 138.7,30.16 139.02,30.48 R31.2
  Top 0.61: C18.2 R32.1
N$15
  Top 0.305: IC4.1 126,26.99 127.27,28.26 128.86,28.26 C18.1
  Top 0.61: C18.1 R32.2 C20.1
N$16
  Top 0.305: IC1.6 118.7,13.02 117.43,11.75 117.43,11.43 117.11,11.11 116.38,11.11 C14.2 | R21.1 112.57,10.89 112.35,11.11 112.35,11.75 112.03,12.07 106.31,12.07 106,11.75 R20.2
  Top 0.61: C14.2 R21.1
N$17
  Top 0.305: C14.1 116.25,8.89 117.11,8.89 118.06,9.84 118.06,11.43 118.38,11.75 IC1.7 121.55,11.75 122.19,12.38 122.19,22.54 122.83,23.18 IC2.3
  Top 0.61: C15.2 R21.2 C14.1
N$18
  Top 0.305: IC2.2 127.27,21.91 127.91,21.27 128.64,21.27 C16.2
  Top 0.61: C16.2 R22.2 R23.1
N$19
  Top 0.305: IC4.6 118.7,29.53 117.11,31.11 | 117.11,31.11 116.25,31.11 C19.2 | R29.1 120.76,32.7 120.13,32.07 118.06,32.07 117.11,31.11
  Top 0.61: R33.1 C19.2
N$20
  Top 0.305: R23.2 137.53,18.95 LED1.A 137.97,18.95 R25.1
N$21
  Top 0.305: IC2.1 126.48,20.64 128.06,19.05 128.76,19.05 C16.1 129.71,18.95 130.13,19.37 130.13,19.68 130.45,20 136.48,20 LED1.K 137.97,21.05 R25.2
  Top 0.61: R25.2 R26.1
N$22
  Top 0.305: R26.2 145.99,18.95 D3.A
N$23
  Top 0.305: D3.C C17.1
  Top 0.61: C17.1 R27.2
N$24
  Top 0.305: F_LED.2 141.88,24.77 142.19,25.08 143.78,25.08 144.1,25.4 R27.1
N$25  (via drill 0.61)
  Top 0.305: IC4.3 126.63,29.53 126.95,29.85 126.95,32.7 | 126.95,32.7 v141.24,32.7 | v137.75,12.3 v130.13,12.3 | R29.2 126.95,32.7
  Top 0.61: R24.2 C15.1
  Bottom 0.305: v141.24,32.7 141.24,29.85 139.97,28.57 139.97,17.14 143.78,13.34 143.78,12.07 142.51,10.8 139.26,10.8 v137.75,12.3 | v130.13,12.3 126.24,12.3 120.28,6.35 119.33,6.35 114.79,10.89 C15.1
  other vias: 111.08,10.89
N$26
  Top 0.305: IC4.7 118.06,28.26 117.43,28.89 116.38,28.89 C19.1
  Top 0.61: C21.1 R33.2 C19.1
N$27
  Top 0.61: R35.1 C21.2
N$28
  Top 0.61: C20.2 R34.1
N$29
  Top 0.61: R6.1 C2.2
N$30  (via drill 0.71 pad 1.12)
  Top 0.254: v9.16,72.39 34.92,72.39 SP.E
  Bottom 0.254: HP.E 8.92,73.88 9.03,73.77 9.03,72.52 v9.16,72.39 SV5.4B SV5.4A
N$31
  Top 0.305: IC2.5 117.74,24.45 117.43,24.13 116.25,24.13 C7.1
  Top 0.61: C7.1 R9.2 R6.2
N$32
  Top 0.61: R7.1 C3.2
N$33  (via drill 0.71 pad 1.12)
  Top 0.254: v37.74,73.03 35.2,70.48 v11.7,70.48
  Bottom 0.254: v11.7,70.48 SV5.5B SV5.5A | v37.74,73.03 40,73.03 SP.S
N$34
  Bottom 0.61: C65.- 67.26,6.19 65.67,4.6 61.71,4.6 SP_KI.2
N$35
  Top 0.305: C12.2 110.19,13.87 109.54,13.22 D1.C
  Top 0.61: D1.C D2.A
N$36
  Top 0.305: IC2.6 117.74,23.18 116.16,21.59 C9.2
  Top 0.61: R7.2 R13.1 C9.2
N$37
  Top 0.254: J2.2 62.5,70.48 57.93,70.48 EXT1.S
N$38
  Bottom 0.254: EXT2.S 23.34,71.76 17.41,71.76 16.78,71.12 J3.2
N$39
  Top 0.305: C13.1 103.46,14.61 103.77,14.92 104.41,14.92 104.73,15.24 104.73,17.46 105.05,17.78 114.57,17.78 114.89,17.46 114.89,13.87
  Top 0.61: R17.2 114.89,13.87 R19.2
N$40
  Top 0.61: R19.1 C12.1
N$41
  Top 0.254: EXT1.E 62.35,65.26 J2.1
N$42
  Top 0.254: J2.3 54.42,69.22 EXT1.A
N$43  (via drill 0.71)
  Top 0.254: v15.51,53.98 20.59,59.05 45.99,59.05 45.99,69.22 48.53,69.22 48.53,64.14 52.34,60.33 67.58,60.33 67.58,73.03 66.31,74.3 LAMP.S
  Bottom 0.254: v15.51,53.98 2.81,53.98 1.54,55.25 SV5.1A
N$44
  Top 0.254: EXT2.A 23.04,66.67 16.78,66.67 J3.3
N$45
  Top 0.254: EXT2.E 25.58,69.22 J3.1
N$46
  Bottom 0.61: SD2.OUT- 33.93,22.86 30.43,19.37 30.43,17.62 30.91,17.14 SJ7.2
N$47  (via drill 0.71)
  Top 0.254: v4.08,59.05 14.24,59.05 14.24,52.71 18.05,52.71 18.05,53.98 21.86,57.79 47.26,57.79 v47.26,67.95
  Bottom 0.254: v4.08,59.05 SV5.2B | v47.26,67.95 52.34,73.03 59.96,73.03 61.23,74.3 LAMP.E
N$48
  Bottom 0.254: HP.S 14,73.03 12.97,72 12.97,67.95 14.24,66.67 SV5.6B SV5.6A
N$49  (via drill 0.71)
  Top 0.305: IC3.14 94.25,19.05 94.57,18.73 94.57,14.61 92.98,13.02 92.98,11.11 JUMPER.4
  Top 0.61: IC3.14 91.08,19.05 90.44,18.41 SJ5.2
  Bottom 0.305: JUMPER.4 92.98,11.11 89.33,11.11 88.22,12.22 88.22,13.81 88.38,13.97 90.28,13.97 91.55,15.24 102.5,15.24 102.82,14.92 104.41,14.92 104.73,15.24 104.73,20 103.46,21.27 R30.2
  other vias: 103.46,24.03
N$50  (via drill 0.71)
  Top 0.61: IC3.15 91.39,17.78 91.08,17.46 91.08,16.83 90.44,16.19 SJ4.2 89.3,15.75 v89.33,15.72
  Bottom 0.61: v89.33,15.72 89.96,15.72 93.2,18.95 R28.2
  other vias: 103.46,18.95
N$51
  Bottom 0.305: R37.2 PROG.8
N$52  (via drill 0.91)
  Bottom 1.524: v92.34,36.04 92.34,39.21
N$53  (via drill 0.91)
  other vias: 92.34,31.43
N$54
  Bottom 1.524: 92.34,31.27 92.34,31.43
N$55
  Bottom 0.406: R55.2 C71.1 44.72,13.97 SD2.HACK
N$56  (via drill 0.71)
  Top 0.254: v43.45,60.33 v1.54,60.33 | v47.26,56.52 71.39,56.52 71.39,74.3 LAMP.A
  Bottom 0.254: v1.54,60.33 SV5.1B | v47.26,56.52 v43.45,60.33
N$57
  Bottom 0.305: R36.2 PROG.4
N$58
  Bottom 0.254: SV5.7B 16.78,67.95 44.72,67.95 49.8,62.87 52.34,62.87 CRM.S
N$59  (via drill 0.61)
  Top 0.254: IC3.6 100.04,22.86 100.2,22.7 v100.76,22.7 | v83.77,22.86 80.06,22.86 R54.1
  Bottom 0.254: v100.76,22.7 99.49,22.7 98.69,23.5 98.69,24.92 102.19,28.42 102.19,33.02 102.98,33.81 102.98,35.56 102.5,36.04 96.63,36.04 94.25,33.66 89.17,33.66 86.63,31.11 86.63,26.67 83.77,23.81 v83.77,22.86
  Bottom 0.305: R54.1 79.42,21.18 79.96,20.64 79.96,17.14 79.64,16.83 78.22,16.83 78.06,16.67 Q3.3
  other vias: 79.42,22.22
N$68  (via drill 0.71 pad 1.12)
  Top 0.254: v19.32,53.34 20.59,54.61 v33.29,54.61
  Bottom 0.254: SV5.8B SV5.8A v19.32,53.34 | v33.29,54.61 33.71,54.2 R46.2
N$69
  Bottom 0.254: GAIN.S 25.46,63.92 21.86,63.92 SV5.9B SV5.9A
N$70
  Bottom 0.254: GAIN.A 24.4,52.28 SV5.10A SV5.10B
N$71
  Bottom 0.61: DSUB1.8 40.89,37.05 D13.2
N$72
  Bottom 0.61: F2.2 26.3,40.64 25.04,41.91 4.08,41.91 0.91,38.73 0.91,11.43 1.54,10.8 L7.1
N$73
  Bottom 0.254: GAIN.E 29.5,54.61 30.14,55.25 31.61,55.25 R46.1
N$74
  Top 0.61: C22.+ 20.59,35.69 20.59,29.97 C47.+
  Bottom 0.61: L7.2 11.7,10.8 12.33,10.16 SD2.INPUT+ 22.5,17.14 C47.+
N$75
  Bottom 0.305: C49.+ 15.29,20.32 C48.1
  Bottom 0.61: R47.2 C48.1 SD2.CONTROL
N$76
  Top 0.61: C47.- 25.67,34.8 25.67,41.28 25.04,41.91 23.26,41.91 C22.-
  Bottom 0.305: 12.75,18 12.75,17.88 C49.-
  Bottom 0.61: C48.2 R47.1 19.54,18 19.64,18.1 19.64,31.11 20.14,31.62 C47.- | SD2.INPUT- C48.2 | L8.2 11.06,19.68 12.75,18 C48.2
N$77  (via drill 0.71)
  Top 0.61: D14.1 91.81,39.37 L9.1
  Bottom 0.61: JP1.1 86.47,37.15 89.17,39.85 92.29,39.85 L9.1
  other vias: 92.34,39.42
N$78
  Bottom 0.61: R50.1 113.3,39.37 112.38,40.29 T2.3
N$80
  Bottom 0.61: D16.C D17.A
N$81  (via drill 0.6)
  Top 0.61: v76.47,31.75 v76.47,40.64
  Bottom 0.61: v76.47,31.75 81.39,26.83 81.39,8.1 79.8,6.51 69.33,6.51 LAMPA.2 | v76.47,40.64 76.47,41.28 77.42,42.23 101.87,42.23 102.27,41.83 T2.2
N$82
  Bottom 0.305: IC11.7 70.13,16.82 71.87,15.08 71.87,13.34 73.3,11.91 C56.1
N$83
  Bottom 0.305: IC11.11 69.87,14.22 70.12,13.97 70.12,12.22 70.6,11.75 72.02,11.75 72.34,11.43 72.34,10.8 72.5,10.64 73.14,10.64 73.52,10.26 C59.1
N$84
  Bottom 0.305: IC11.21 61.83,18.77 60.91,19.68 C61.1
N$85
  Bottom 0.305: IC11.16 61.99,15.52 61.07,14.61 C60.1
N$86
  Top 0.61: R52.2 C63.1 67.04,11.97 67.58,11.43 68.21,11.43 C65.+ 70.75,10.8 L10.2
N$87
  Top 0.61: L12.1 68.06,20 | 68.06,20 R53.1 | L11.2 70.28,20 | C64.2 70.28,20 | 70.28,20 68.06,20
N$89
  Bottom 0.61: HP_KI.2 52.66,4.7 R56.1 52.88,6.09 53.13,6.35 60.6,6.35 C66.-
N$90
  Bottom 0.305: IC11.6 70.43,17.47 72.02,15.88 72.66,15.88 72.88,15.65 C68.2
N$91
  Bottom 0.305: IC11.5 70.73,18.12 71.71,17.14 C69.2
N$92
  Bottom 0.305: IC11.18 62.18,16.82 61.87,16.51 61.87,16.27 61.47,15.88 59.48,15.88 59.17,16.19 SJ2.2
N$93  (via drill 0.61)
  Top 0.305: v73.93,13.49 72.18,15.24 SJ8.1
  Bottom 0.305: IC11.4 71.67,18.77 72.02,18.41 73.61,18.41 73.93,18.1 v73.93,13.49
N$94
  Bottom 0.61: D19.C D18.A 40.48,18.84 41.13,18.2 R55.1
N$95
  Top 0.61: L12.2 59.62,18.55 59.33,18.26 59.33,15.56 59.64,15.24 | 59.64,15.24 C70.2 | C66.+ 59.33,10.8 59.33,14.92 59.64,15.24
OUT+  (via drill 0.71)
  Top 0.305: v116.79,27.62 99.49,27.62 98.85,28.26 90.6,28.26 87.74,25.4 71.39,25.4 69.8,23.81 67.1,23.81 66.79,24.13 64.41,24.13 63.87,24.67 RJ2.6 65.17,26.99 65.83,26.99 66.47,27.62 66.47,28.73 66.94,29.21 66.94,32.39 59.64,39.69 41.23,39.69 39.5,37.96 DSUB1.4 | v133.94,27.62 135.84,27.62 136.48,28.26 R34.2
  Bottom 0.305: v116.79,27.62 v133.94,27.62
OUT-
  Top 0.305: R35.2 109.49,29.05 109.01,28.89 108.7,28.89 108.06,28.26 99.81,28.26 99.17,28.89 90.28,28.89 87.42,26.04 71.07,26.04 69.48,24.45 68.21,24.45 67.67,24.99 RJ2.3 67.67,32.61 59.96,40.32 40.91,40.32 36.73,36.15 DSUB1.5
POTI_JEL  (via drill 0.71)
  Top 0.305: POTI.7 POTI.8
  Bottom 0.305: C13.2 91.33,15.97 89.96,14.61 87.9,14.61 87.58,14.29 87.58,11.91 89.17,10.32 90.12,10.32 90.44,10 90.44,9.21 91.08,8.57 98.06,8.57 99.01,9.52 102.82,9.52 107.27,13.97 107.27,17.3 108.7,18.73 116.16,18.73 121.55,13.34 135.05,13.34 135.37,13.02 135.37,5.87 POTI.8
  other vias: 103.46,15.97
SP
  Top 0.305: POTI.9 POTI.10
  Bottom 0.305: JUMPER.5 92.98,13.65 94.88,13.65 95.52,13.02 95.52,11.43 95.84,11.11 103.46,11.11 106.63,14.29 106.63,17.62 108.38,19.37 116.47,19.37 121.87,13.97 135.37,13.97 136,13.34 136,7.78 POTI.10
SPIN_X  (via drill 0.71)
  Top 0.305: SJ4.1 83.14,16.19 80.76,13.81 v79.49,13.81
  Bottom 0.305: C68.1 76.23,14.84 76.95,14.13 78.53,14.13 78.85,13.81 v79.49,13.81
SPM  (via drill 0.71)
  Top 0.305: IC3.10 v94.73,24.13 | DIGIT.6 DIGIT.5
  Bottom 0.305: DIGIT.6 112.98,0.95 91.08,0.95 90.44,1.59 90.44,5.72 89.65,6.51 88.38,6.51 84.72,10.16 84.72,17.46 86.31,19.05 88.85,19.05 91.08,21.27 91.08,23.18 92.03,24.13 v94.73,24.13
SPOUT  (via drill 0.71)
  Top 0.305: v80.12,10.8 L10.1
  Bottom 0.305: IC11.15 62.21,14.87 61.71,14.37 61.71,13.65 61.39,13.34 | v80.12,10.8 77.26,7.94 72.5,7.94 72.18,8.25 72.18,9.84 70.91,11.11 69.48,11.11 69.33,11.27 66.63,11.27 65.67,10.32 64.41,10.32 61.39,13.34 | C71.2 45.73,18.2 45.99,17.94 45.99,17.46 46.31,17.14 49.48,17.14 49.8,16.83 49.8,13.34 52.34,10.8 57.1,10.8 58.28,11.97 C60.2 59.01,14.61 59.33,14.29 59.33,13.65 59.64,13.34 61.39,13.34
VDD  (via drill 0.61, 0.71)
  Top 0.305: v118.54,20.64 IC2.8 | IC1.8 121.4,10.48 122.83,11.91 122.83,17.14 v123.3,17.62 | IC4.8 119.91,26.41 v119.97,26.35 | R1.2 v141.56,13.02
  Top 0.61: SJ2.1 61.87,18.32 61.87,21.27 61.07,22.07 57.9,22.07 56.79,20.95 56.79,19.05 C57.+ 52.34,19.68 52.34,22.86 53.29,23.81 55.2,23.81 55.67,24.29 62.02,24.29 64.56,21.75 70.6,21.75 v70.91,22.07 72.34,23.5 73.93,23.5 76.63,20.8 76.63,18.73 75.83,17.94 75.83,16.83 78.22,14.45 78.22,12.86 78.53,12.54 89.01,12.54 v89.33,12.86
  Bottom 0.305: IC11.19 IC11.20 62.21,18.12 61.87,17.78 61.87,17.46 61.55,17.14 SJ2.1 | v89.33,12.86 90.12,12.86 91.87,14.61 102.19,14.61 102.5,14.29 104.73,14.29 105.36,14.92 105.36,18.26 107.74,20.64 v118.54,20.64 | v118.54,20.64 C26.1 122.73,19.46 123.3,18.89 v123.3,17.62 | v119.97,26.35 119.97,22.07 v118.54,20.64 | v141.56,13.02 139.34,15.24 122.98,15.24 118.54,19.68 v118.54,20.64 | IC11.2 70.5,20.07 71.39,20.95 71.39,21.59 v70.91,22.07
  Bottom 0.61: R51.1 49.99,18.54 51.17,17.36 C58.1 54.66,17.36 C57.+
  other vias: 60.69,17.14
VSS  (via drill 0.61, 0.71)
  Top 0.305: IC1.4 125.11,15.86 v125.84,16.59 C27.2 | v129.97,22.7 127.75,22.7 126,24.45 IC2.4 | IC4.4 123.14,30.8 122.51,31.43 122.51,33.66 122.83,33.97 v125.68,33.97
  Top 0.61: v32.02,6.99 38.37,6.99 40.91,4.45 42.18,4.45 43.45,5.72 v43.45,7.3 | v45.99,9.84 48.69,7.14 71.23,7.14 72.66,8.57 88.53,8.57 v89.17,9.21 | v100.76,24.13 IC3.7
  Bottom 0.305: v125.68,33.97 132.67,33.97 137.59,29.05 137.59,24.77 134.89,22.07 130.6,22.07 v129.97,22.7 125.84,18.57 v125.84,16.59
  Bottom 0.61: SJ1.1 v32.02,6.99 | v43.45,7.3 v45.99,9.84 | v89.17,9.21 88.85,9.21 86.79,11.27 86.79,16.35 87.42,16.99 89.8,16.99 93.77,20.95 100.92,20.95 102.03,22.07 102.03,23.81 101.71,24.13 v100.76,24.13 104.57,27.94 104.57,29.85 107.11,32.39 124.09,32.39 v125.68,33.97
X0
  Top 0.305: IC3.12 94.57,21.59 95.84,20.32 95.84,14.37 96.47,13.73 97.66,13.73 98.38,13.02 98.38,11.43 98.06,11.11 95.52,11.11 JUMPER.3

## Text on the board
Top: TOP | M12 TAP_AN_ER | E | TEQ NARVAL | 2015 | D
Bottom: M12 TAP_AN_ER | TEQ NARVAL | 2015
tNames: E | +5V | GND | D | PGC | CANL | CANH | MH | SPM | CRM | L_CS | AGND | CS_M | M | CS | m | MCLR | MIC_MUTE | PGD | MUTE | CSIP | L_m | L_M | SP | HP | C_CS | GAIN